# EAGLE design 2021-02-22_16-12-10 (EAGLE 9.6.2)
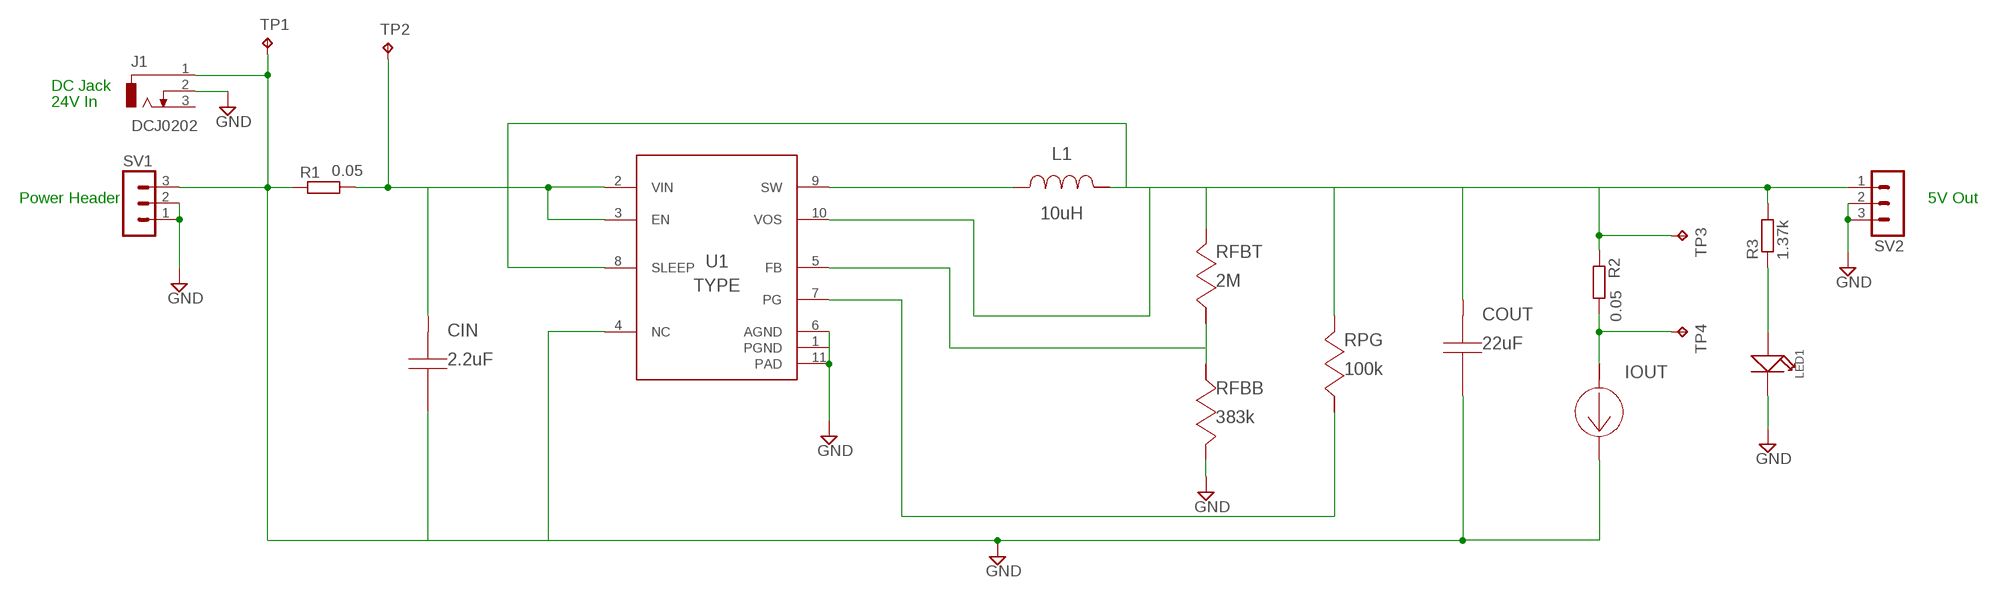
[diagram p0: schematic, sheet 1]

## Parts
CIN  2.2uF  GRM21BR71E225KA73LGRM21BR71E225KA73L  [0805]
COUT  22uF  C1608X5R1A226M080ACC1608X5R1A226M080AC  [0603]
IOUT  WB_CURRENT_LOAD  WB_CURRENT_LOADWB_CURRENT_LOAD  [WB_CURRENT_LOAD]
J1  DCJ0202  [DCJ0202]
L1  10uH  NPI54C100MTRFNPI54C100MTRF  [IND_NPI54C]
LED1  LED-THT  [LED-THT]
R1  0.05  RESISTOR-0603  [R0603]
R2  0.05  RESISTOR-0603  [R0603]
R3  1.37k  RESISTOR-0603  [R0603]
RFBB  383k  CRCW0402383KFKEDCRCW0402383KFKED  [0402]
RFBT  2M  CRCW04022M00FKEDCRCW04022M00FKED  [0402]
RPG  100k  CRCW0402100KFKEDCRCW0402100KFKED  [0402]
SV1  MA03-1  [MA03-1]
SV2  MA03-1  [MA03-1]
TP1  TPPAD1-20  [P1-20]
TP2  TPPAD1-20  [P1-20]
TP3  TPPAD1-20  [P1-20]
TP4  TPPAD1-20  [P1-20]
U1  TPS62175DQCR  TPS62175DQCRTPS62175DQCR  [DQC0010A]

## Nets
1: RPG.2 U1.7(PG)
2: COUT.1 RFBT.1 RPG.1 U1.8(SLEEP) U1.10(VOS)
3: L1.1 U1.9(SW)
4: RFBB.2 RFBT.2 U1.5(FB)
5: CIN.2 U1.4(NC)
GND: COUT.2 IOUT.2(-) J1.1 J1.2 LED1.1(MINUS) R1.1 RFBB.1 SV1.1 SV1.2 SV1.3 SV2.2 SV2.3 TP1.TP U1.1(PGND) U1.6(AGND) U1.11(PAD)
N$1: CIN.1 R1.2 TP2.TP U1.2(VIN) U1.3(EN)
N$2: IOUT.1(+) R2.2 TP4.TP
N$3: L1.2 R2.1 R3.2 SV2.1 TP3.TP
N$4: LED1.2(PLUS) R3.1
Unconnected: J1.3

## Notes on the sheet
- DC Jack
- 24V In
- Power Header | 5V Out

## Library data of the parts
CIN = AcceleratedDesigns_Lib:GRM21BR71E225KA73L; CAP: 2.2E-6; ESR: 0.0050; IRMS: 0.0; MANUFACTURER_NAME: MuRata; MANUFACTURER_PART_NUMBER: GRM21BR71E225KA73L; VDC: 25.0; VENDOR: MuRata
COUT = AcceleratedDesigns_Lib:C1608X5R1A226M080AC; CAP: 2.2E-5; DATASHEET_URL: https://product.tdk.com/en/search/capacitor/ceramic/mlcc/info?part%5Fno%3DC1608X5R1A226M080AC; ESR: 0.00371; IRMS: 2.69936; MANUFACTURER_NAME: TDK; MANUFACTURER_PART_NUMBER: C1608X5R1A226M080AC; VDC: 10.0; VENDOR: TDK
IOUT = AcceleratedDesigns_Lib:WB_CURRENT_LOAD; MANUFACTURER_NAME: WB_CURRENT_LOAD; MANUFACTURER_PART_NUMBER: WB_CURRENT_LOAD; POWERPORTTYPE: POWER_GROUND; VALUE: Value
J1 = con-jack:DCJ0202: DC POWER JACK Source: DCJ0202.pdf; OC_FARNELL: unknown; OC_NEWARK: unknown
L1 = AcceleratedDesigns_Lib:NPI54C100MTRF; DCR: 0.09; IDC: 1.8; L: 1.0E-5; MANUFACTURER_NAME: NIC Components; MANUFACTURER_PART_NUMBER: NPI54C100MTRF; VENDOR: NIC Components
LED1 = Controller:LED: Single color LED
R1-R3 = Components:RESISTOR
RFBB = AcceleratedDesigns_Lib:CRCW0402383KFKED; MANUFACTURER_NAME: Vishay-Dale; MANUFACTURER_PART_NUMBER: CRCW0402383KFKED; POWER: 0.063; RESISTANCE: 383000.0; TOLERANCE: 1.0; VENDOR: Vishay-Dale
RFBT = AcceleratedDesigns_Lib:CRCW04022M00FKED; MANUFACTURER_NAME: Vishay-Dale; MANUFACTURER_PART_NUMBER: CRCW04022M00FKED; POWER: 0.063; RESISTANCE: 2000000.0; TOLERANCE: 1.0; VENDOR: Vishay-Dale
RPG = AcceleratedDesigns_Lib:CRCW0402100KFKED; MANUFACTURER_NAME: Vishay-Dale; MANUFACTURER_PART_NUMBER: CRCW0402100KFKED; POWER: 0.063; RESISTANCE: 100000.0; TOLERANCE: 1.0; VENDOR: Vishay-Dale
SV1 SV2 = con-lstb:MA03-1: PIN HEADER; OC_FARNELL: unknown; OC_NEWARK: unknown
TP1-TP4 = testpad:TP: Test pad
U1 = AcceleratedDesigns_Lib:TPS62175DQCR; MANUFACTURER: Texas Instruments; MANUFACTURER_NAME: Texas Instruments; MANUFACTURER_PART_NUMBER: TPS62175DQCR; PARTNUMBER: TPS62175DQCR; REFDES: RefDes; TYPE: TYPE; VALUE: Value

## Board
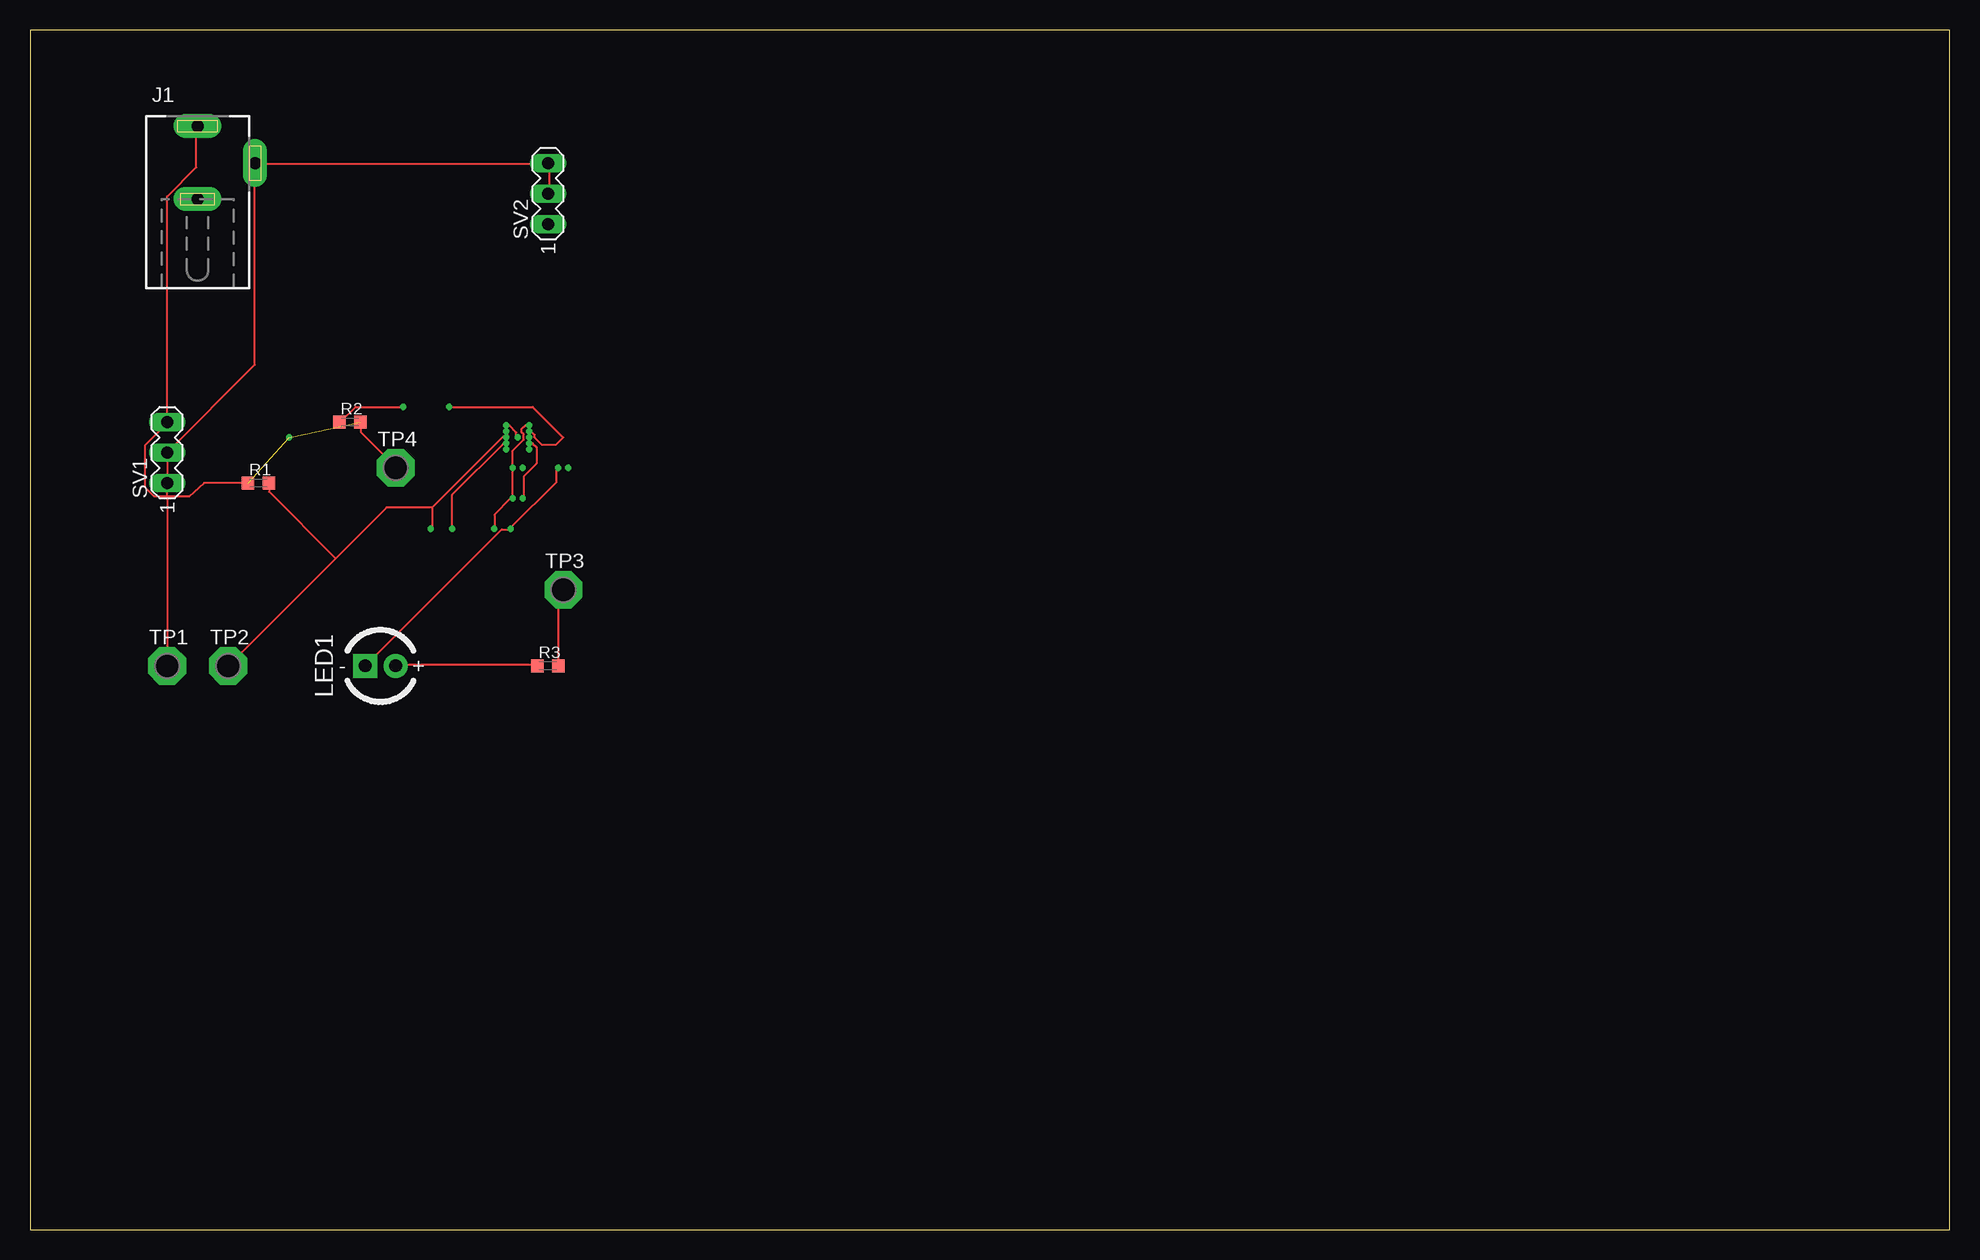
[diagram p1: board, top side]
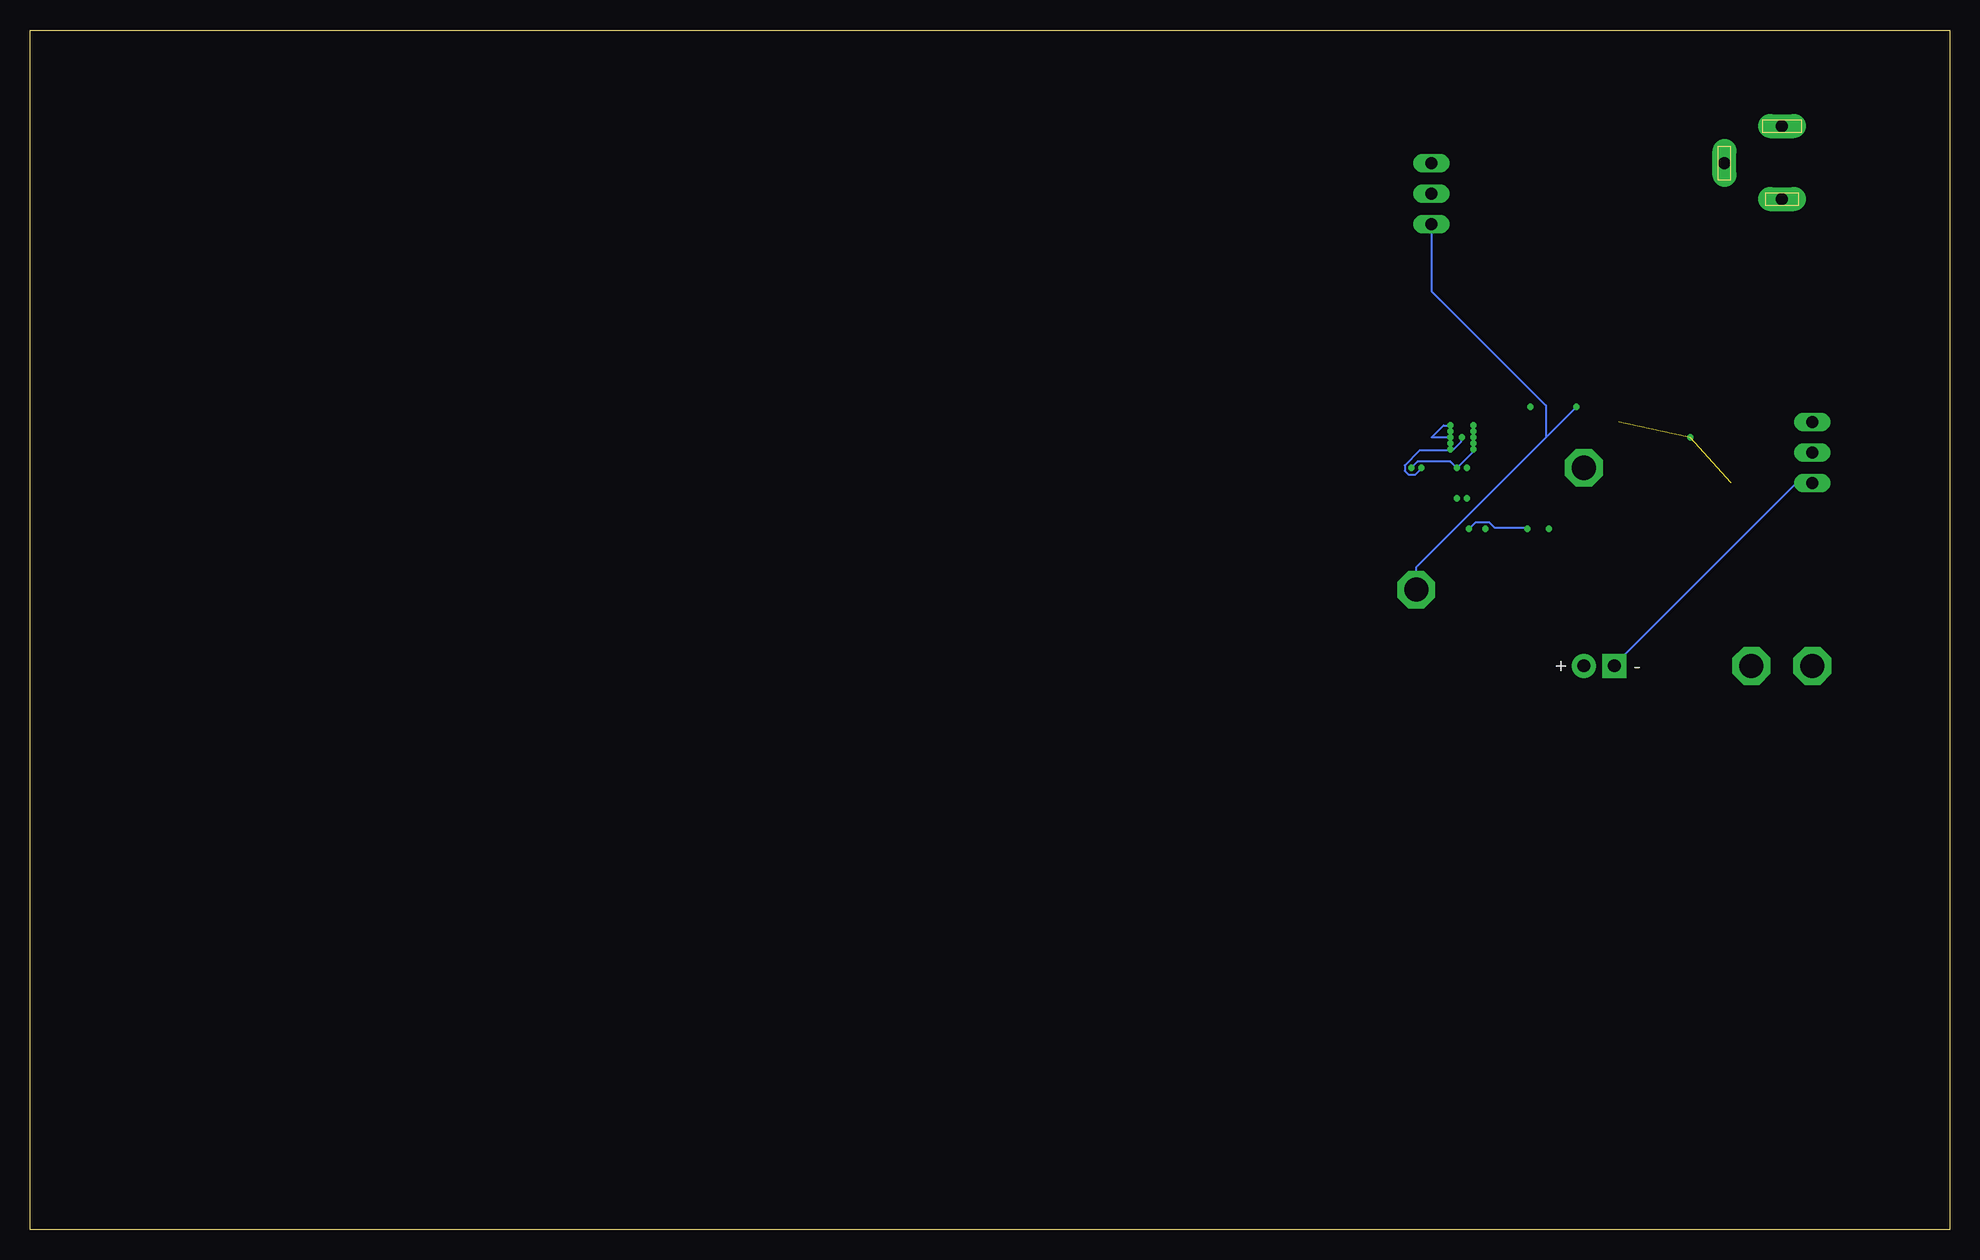
[diagram p2: board, bottom side, seen from below]

Size 160 x 100 mm. Coordinates in mm from the lower left corner, seen from the top.
Outline: 0,0 160,0 160,100 0,100 0,0
Copper layers (1*16): Top 0.035mm / dielectric 1.5mm / Bottom 0.035mm
Design rules "default": minimum track width 6mil, minimum drill 0.35mm, track to track 6mil, track to pad 6mil, pad to pad 6mil, via to via 6mil, smd to smd 6mil, copper to edge 40mil, drill to drill 6mil, minimum pad ring 10mil, minimum via ring 8mil, stop-mask expansion 4mil, vias tented up to drill 0mil, thermal gap 10mil

### Footprints (pad centres in the part's own frame; a part is rotated, then mirrored left to right if it is on the bottom)
0805 = drill 0: 1 -0.902,0; 2 0.902,0
0603 = drill 0: 1 -0.699,0; 2 0.699,0
WB_CURRENT_LOAD = drill 0: 1 0,0; 2 0,0
DCJ0202 = drill 1 pad 2 long: 1 0,3.1; 2 4.8,0; 3 0,-3
IND_NPI54C = drill 0: 1 -1.924,0; 2 1.924,0
LED-THT = drill 1.05 pad 2 square: 1 -1.27,0 | drill 1.05 pad 2: 2 1.27,0
R0603 = smd 1.05 x 1.08: 1 -0.875,0; 2 0.875,0
0402 = drill 0: 1 -0.419,0; 2 0.419,0
MA03-1 = drill 1.016 long: 1 -2.54,0; 2 0,0; 3 2.54,0
P1-20 = drill 2.007 pad 3.15 octagon: TP 0,0
DQC0010A = drill 0: 1 -0.95,1; 2 -0.95,0.5; 3 -0.95,0; 4 -0.95,-0.5; 5 -0.95,-1; 6 0.95,-1; 7 0.95,-0.5; 8 0.95,0; 9 0.95,0.5; 10 0.95,1; 11 0,0

### Placement (x,y rotation side)
CIN  34.29,58.42 0 top
COUT  39.37,58.42 0 top
IOUT  21.59,66.04 0 bottom
J1  13.97,88.9 0 top
L1  33.02,68.58 180 top
LED1  29.21,46.99 0 top
R1  19.05,62.23 0 top
R2  26.67,67.31 0 top
R3  43.18,46.99 0 top
RFBB  44.45,63.5 0 top
RFBT  40.64,63.5 0 top
RPG  40.64,60.96 0 top
SV1  11.43,64.77 90 top
SV2  43.18,86.36 90 top
TP1  11.43,46.99 0 top
TP2  16.51,46.99 0 top
TP3  44.45,53.34 0 top
TP4  30.48,63.5 0 top
U1  40.64,66.04 0 top

### Tracks (layer width: path | path; a pad name or v marks a point on that pad's centre or on a via)
1
  Top 0.152: RPG.2 41.15,60.96 41.15,62.79 42.22,63.86 42.22,65.23 41.91,65.53 41.6,65.53 U1.7
2
  Top 0.152: COUT.1 38.71,58.52 38.71,59.59 40.08,60.96 RPG.1 40.23,60.96 40.23,63.4 RFBT.1 40.23,63.55 40.23,64.92 41.15,65.84 41.15,66.29 41,66.45 41,66.75 41.3,67.06 41.45,67.06 U1.10
  Bottom 0.152: U1.8 43.18,66.04 42.18,67.04 U1.10
3
  Top 0.152: L1.1 41.91,68.58 44.45,66.04 43.81,65.41 42.71,65.41 42.07,66.04 42.07,66.24 41.79,66.52 41.61,66.52 U1.9
  Bottom 0.152: 41.61,66.52 U1.9
4
  Bottom 0.152: U1.5 39.62,64.92 41,63.55 RFBT.2 41.15,63.55 41.6,64.01 44.35,64.01 44.81,63.55 RFBB.2
5
  Top 0.152: 39.78,65.53 U1.4 39.62,65.53 39.47,65.53 35.2,61.27 35.2,58.52 CIN.2
  Bottom 0.152: 39.93,58.52 39.47,58.98 38.41,58.98 37.95,58.52 35.2,58.52 CIN.2
GND  (1 unrouted)
  Top 0.152: SV2.2 43.28,86.41 43.28,88.85 SV2.3 43.13,88.85 18.9,88.85 J1.2 18.75,88.85 18.75,72.08 SV1.2 SV1.1 11.43,61.11 | 39.93,67.06 39.78,67.06 U1.1 39.93,67.06 | 11.43,61.11 13.26,61.11 14.52,62.23 R1.1 18.54,61.86 | 11.43,61.11 10.36,61.11 9.6,61.87 9.6,65.38 11.43,67.21 SV1.3 11.43,86.11 13.87,88.54 13.87,91.9 J1.1 | 11.43,61.11 TP1.TP | RFBB.1 43.89,63.4 43.89,62.33 40.08,58.52 COUT.2 39.93,58.37 39.32,58.37 LED1.1 | 39.93,67.06 40.54,66.45 40.54,66.14 U1.11
  Bottom 0.152: SV1.1 11.43,62.18 12.8,62.18 27.89,47.09 LED1.1 | RFBB.1 44.04,63.4 44.5,62.94 45.11,62.94 45.41,63.25 45.41,63.7 44.2,64.92 41.6,64.92 U1.6 41.45,64.92 40.69,65.68 40.69,65.99 U1.11
N$1
  Top 0.152: 33.53,60.2 33.53,58.52 CIN.1 | 25.48,55.96 19.93,61.51 R1.2 | 33.53,60.2 29.72,60.2 25.48,55.96 | 25.48,55.96 TP2.TP | U1.2 39.78,66.45 39.78,66.14 U1.3 39.62,66.14 39.47,66.14 33.53,60.2
N$2  (1 unrouted)
  Top 0.152: 27.58,67.36 R2.2 27.58,67.21 27.58,66.45 30.48,63.55 TP4.TP
N$3
  Top 0.152: R3.2 44.05,52.95 TP3.TP | L1.2 27.13,68.58 25.91,67.36 R2.1
  Bottom 0.152: SV2.1 43.13,83.82 43.13,78.18 33.64,68.69 33.64,66.04 L1.2 44.45,55.23 TP3.TP
N$4
  Top 0.152: R3.1 42.22,47.09 30.48,47.09 LED1.2